# EAGLE design wavplayer-v1 (EAGLE 6.5.0)
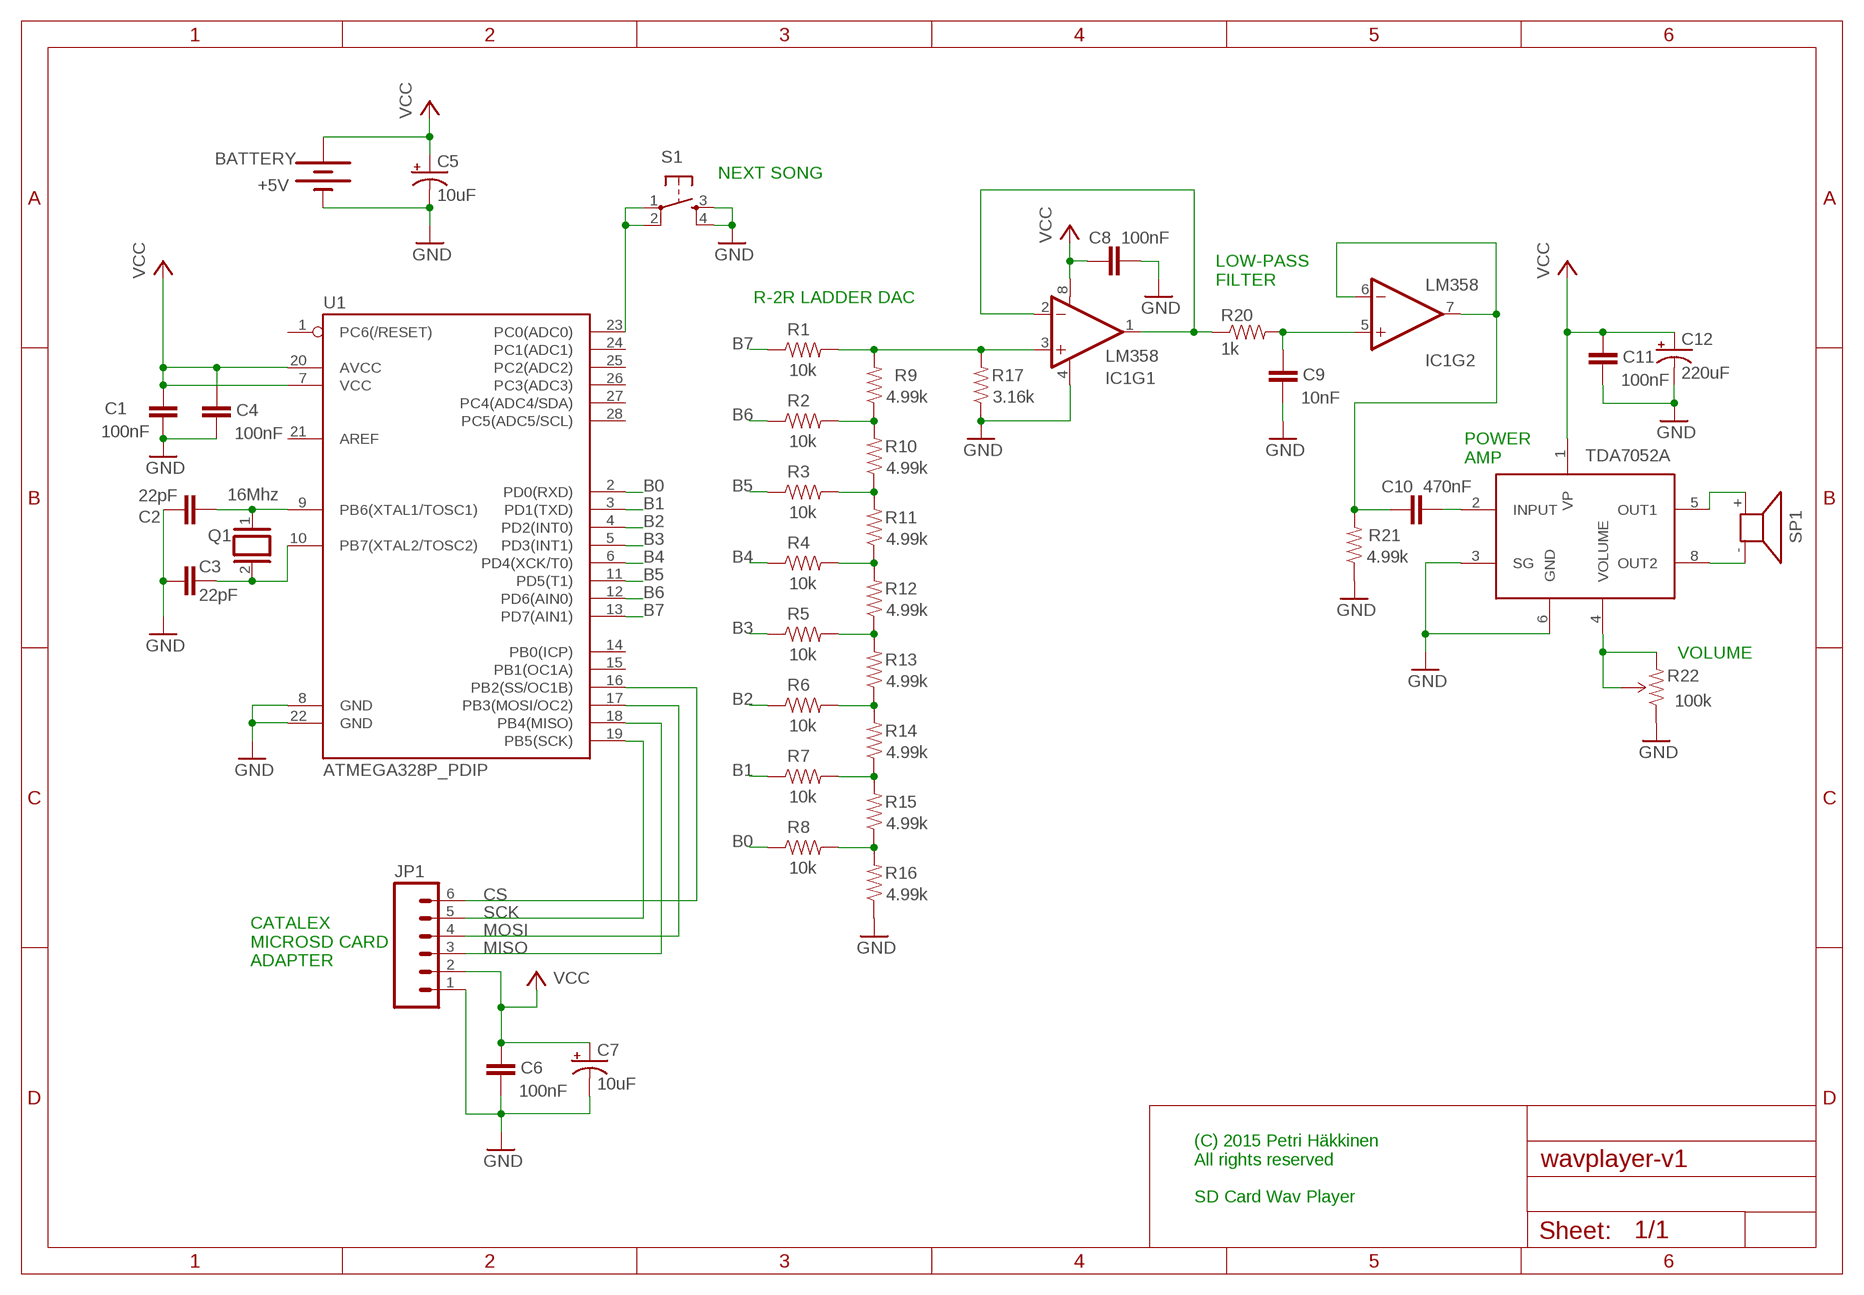
[diagram p0: schematic, sheet 1]

## Parts
BATTERY  +5V  BATTERYAA  [BATTERY-AA]
C1  100nF  CAPPTH  [CAP-PTH-SMALL]
C2  22pF  CAPPTH  [CAP-PTH-SMALL]
C3  22pF  CAPPTH  [CAP-PTH-SMALL]
C4  100nF  CAPPTH  [CAP-PTH-SMALL]
C5  10uF  CAP_POLPTH1  [CPOL-RADIAL-100UF-25V]
C6  100nF  CAPPTH  [CAP-PTH-SMALL]
C7  10uF  CAP_POLPTH1  [CPOL-RADIAL-100UF-25V]
C8  100nF  CAPPTH  [CAP-PTH-SMALL]
C9  10nF  CAPPTH  [CAP-PTH-SMALL]
C10  470nF  CAPPTH  [CAP-PTH-SMALL]
C11  100nF  CAPPTH  [CAP-PTH-SMALL]
C12  220uF  CAP_POLPTH1  [CPOL-RADIAL-100UF-25V]
IC1  LM358  [DIP08]
JP1  M06LONGPADS  [1X06_LONGPADS]
Q1  16Mhz  XTAL/S  [QS]
R1  10k  RESISTORPTH-1/4W  [AXIAL-0.4]
R2  10k  RESISTORPTH-1/4W  [AXIAL-0.4]
R3  10k  RESISTORPTH-1/4W  [AXIAL-0.4]
R4  10k  RESISTORPTH-1/4W  [AXIAL-0.4]
R5  10k  RESISTORPTH-1/4W  [AXIAL-0.4]
R6  10k  RESISTORPTH-1/4W  [AXIAL-0.4]
R7  10k  RESISTORPTH-1/4W  [AXIAL-0.4]
R8  10k  RESISTORPTH-1/4W  [AXIAL-0.4]
R9  4.99k  RESISTORPTH-1/4W  [AXIAL-0.4]
R10  4.99k  RESISTORPTH-1/4W  [AXIAL-0.4]
R11  4.99k  RESISTORPTH-1/4W  [AXIAL-0.4]
R12  4.99k  RESISTORPTH-1/4W  [AXIAL-0.4]
R13  4.99k  RESISTORPTH-1/4W  [AXIAL-0.4]
R14  4.99k  RESISTORPTH-1/4W  [AXIAL-0.4]
R15  4.99k  RESISTORPTH-1/4W  [AXIAL-0.4]
R16  4.99k  RESISTORPTH-1/4W  [AXIAL-0.4]
R17  3.16k  RESISTORPTH-1/4W  [AXIAL-0.4]
R20  1k  RESISTORPTH-1/4W  [AXIAL-0.4]
R21  4.99k  RESISTORPTH-1/4W  [AXIAL-0.4]
R22  100k  TRIMPOTPTH  [TRIM_POT_PTH]
S1  TAC_SWITCHPTH  [TACTILE-PTH]
SP1  AL11P  [AL11P]
U1  ATMEGA328P_PDIP  [DIL28-3]
U$1  TDA7052B  [DIL08]

## Nets
B0: R8.P$1 U1.2(PD0(RXD))
B1: R7.P$1 U1.3(PD1(TXD))
B2: R6.P$1 U1.4(PD2(INT0))
B3: R5.P$1 U1.5(PD3(INT1))
B4: R4.P$1 U1.6(PD4(XCK/T0))
B5: R3.P$1 U1.11(PD5(T1))
B6: R2.P$1 U1.12(PD6(AIN0))
B7: R1.P$1 U1.13(PD7(AIN1))
CS: JP1.6 U1.16(PB2(SS/OC1B))
GND: BATTERY.GND@1(-) C1.2 C2.2 C3.2 C4.2 C5.2(-) C6.2 C7.2(-) C8.2 C9.2 C11.2 C12.2(-) IC1.4(V-) JP1.1 R16.P$1 R17.P$1 R21.P$1 R22.1(CCW) S1.3 S1.4 U1.8(GND) U1.22(GND) U$1.3(SG) U$1.6(GND)
MISO: JP1.3 U1.18(PB4(MISO))
MOSI: JP1.4 U1.17(PB3(MOSI/OC2))
N$1: C2.1 Q1.1 U1.9(PB6(XTAL1/TOSC1))
N$2: C3.1 Q1.2 U1.10(PB7(XTAL2/TOSC2))
N$3: R4.P$2 R11.P$1 R12.P$2
N$4: R5.P$2 R12.P$1 R13.P$2
N$5: R6.P$2 R13.P$1 R14.P$2
N$6: R3.P$2 R10.P$1 R11.P$2
N$7: R7.P$2 R14.P$1 R15.P$2
N$8: R2.P$2 R9.P$1 R10.P$2
N$9: R8.P$2 R15.P$1 R16.P$2
N$10: IC1.3(+IN) R1.P$2 R9.P$2 R17.P$2
N$11: C9.1 IC1.5(+IN) R20.P$2
N$12: C10.1 IC1.6(-IN) IC1.7(OUT) R21.P$2
N$13: IC1.1(OUT) IC1.2(-IN) R20.P$1
N$14: SP1.- U$1.8(OUT2)
N$15: C8.1 IC1.8(V+) ; supply symbol labelled VCC
N$16: SP1.+ U$1.5(OUT1)
N$18: C10.2 U$1.2(INPUT)
N$19: R22.2(WIPER) R22.3(CW) U$1.4(VOLUME)
N$25: S1.1 S1.2 U1.23(PC0(ADC0))
SCK: JP1.5 U1.19(PB5(SCK))
VCC: BATTERY.PWR@1(+) C1.1 C4.1 C5.1(+) C6.1 C7.1(+) C11.1 C12.1(+) JP1.2 U1.7(VCC) U1.20(AVCC) U$1.1(VP)
Unconnected: U1.1(PC6(/RESET)) U1.14(PB0(ICP)) U1.15(PB1(OC1A)) U1.21(AREF) U1.24(PC1(ADC1)) U1.25(PC2(ADC2)) U1.26(PC3(ADC3)) U1.27(PC4(ADC4/SDA)) U1.28(PC5(ADC5/SCL))

## Notes on the sheet
- NEXT SONG
- LOW-PASS
  FILTER
- R-2R LADDER DAC
- TDA7052A
- POWER
  AMP
- VOLUME
- CATALEX
  MICROSD CARD
  ADAPTER
- (C) 2015 Petri Häkkinen
  All rights reserved
  
  SD Card Wav Player

## Library data of the parts
BATTERY = SparkFun-Electromechanical:BATTERY: Battery Holders Various common sizes : AA, AAA, 20mm coin cell and 12mm coin cell. 20MM_4LEGS, BATT-10373
C1-C4 C6 C8-C11 = SparkFun-Capacitors:CAP: Capacitor Standard 0603 ceramic capacitor, and 0.1" leaded capacitor.
C5 C7 C12 = SparkFun-Capacitors:CAP_POL: Capacitor Polarized These are standard SMD and PTH capacitors. Normally 10uF, 47uF, and 100uF in electrolytic and tantalum varieties. Always verify the external diameter of the through hole cap, it varies with capacity, voltage, and manufacturer. The EIA devices should be standard.
IC1 = SparkFun-AnalogIC:LM358: Jellybean op-amp; PROD_ID: IC-09172
JP1 = SparkFun-Connectors:M06: Header 6 Standard 6-pin 0.1" header. Use with straight break away headers (SKU : PRT-00116), right angle break away headers (PRT-00553), swiss pins (PRT-00743), machine pins (PRT-00117), and female headers (PRT-00115). Molex polarized connector foot print use with SKU : PRT-08094 with associated crimp pins and housings. NOTES ON THE VARIANTS LOCK and LOCK_LONGPADS... This footprint was designed to help hold the alignment of a through-hole component (i.e. 6-pin header) while soldering it into place. You may notice that each hole has been shifted either up or down by 0.005 of an inch from it's more standard position (which is a perfectly straight line). This slight alteration caused the pins (the squares in the middle) to touch the edges of the holes. Because they are alternating, it causes a "brace" to hold the component in place. 0.005 has proven to be the perfect amount of "off-center" position when using our standard breakaway headers. Although looks a little odd when you look at the bare footprint, once you have a header in there, the alteration is very hard to notice. Also,if you push a header all the way into place, it is covered up entirely on the bottom side. This idea of altering the position of holes to aid alignment will be further integrated into the Sparkfun Library for other footprints. It can help hold any component with 3 or more connection pins.
Q1 = special:XTAL/S: CRYSTAL
R1-R17 R20 R21 = SparkFun-Passives:RESISTOR: Resistor Basic schematic elements and footprints for 0603, 1206, and PTH resistors.
R22 = SparkFun-Electromechanical:TRIMPOT: Various small potentiometers for "set-and-forget" applications
S1 = SparkFun-Electromechanical:TAC_SWITCH: Momentary Switch Button commonly used for reset or general input. Spark Fun Electronics SKU : COM-00097 SMT- SWCH-08247
SP1 = buzzer:AL11P: SPEAKER Source: Buerklin; OC_FARNELL: unknown; OC_NEWARK: unknown
U1 = SparkFun-DigitalIC:ATMEGA328P_PDIP: uC used in the Arduino 32kb flash, 1k EEPROM, 2k SRAM This is the through-hole version of this chip.
U$1 = tda7052b:TDA7052B: 1W Mono audio amplifier

## Board
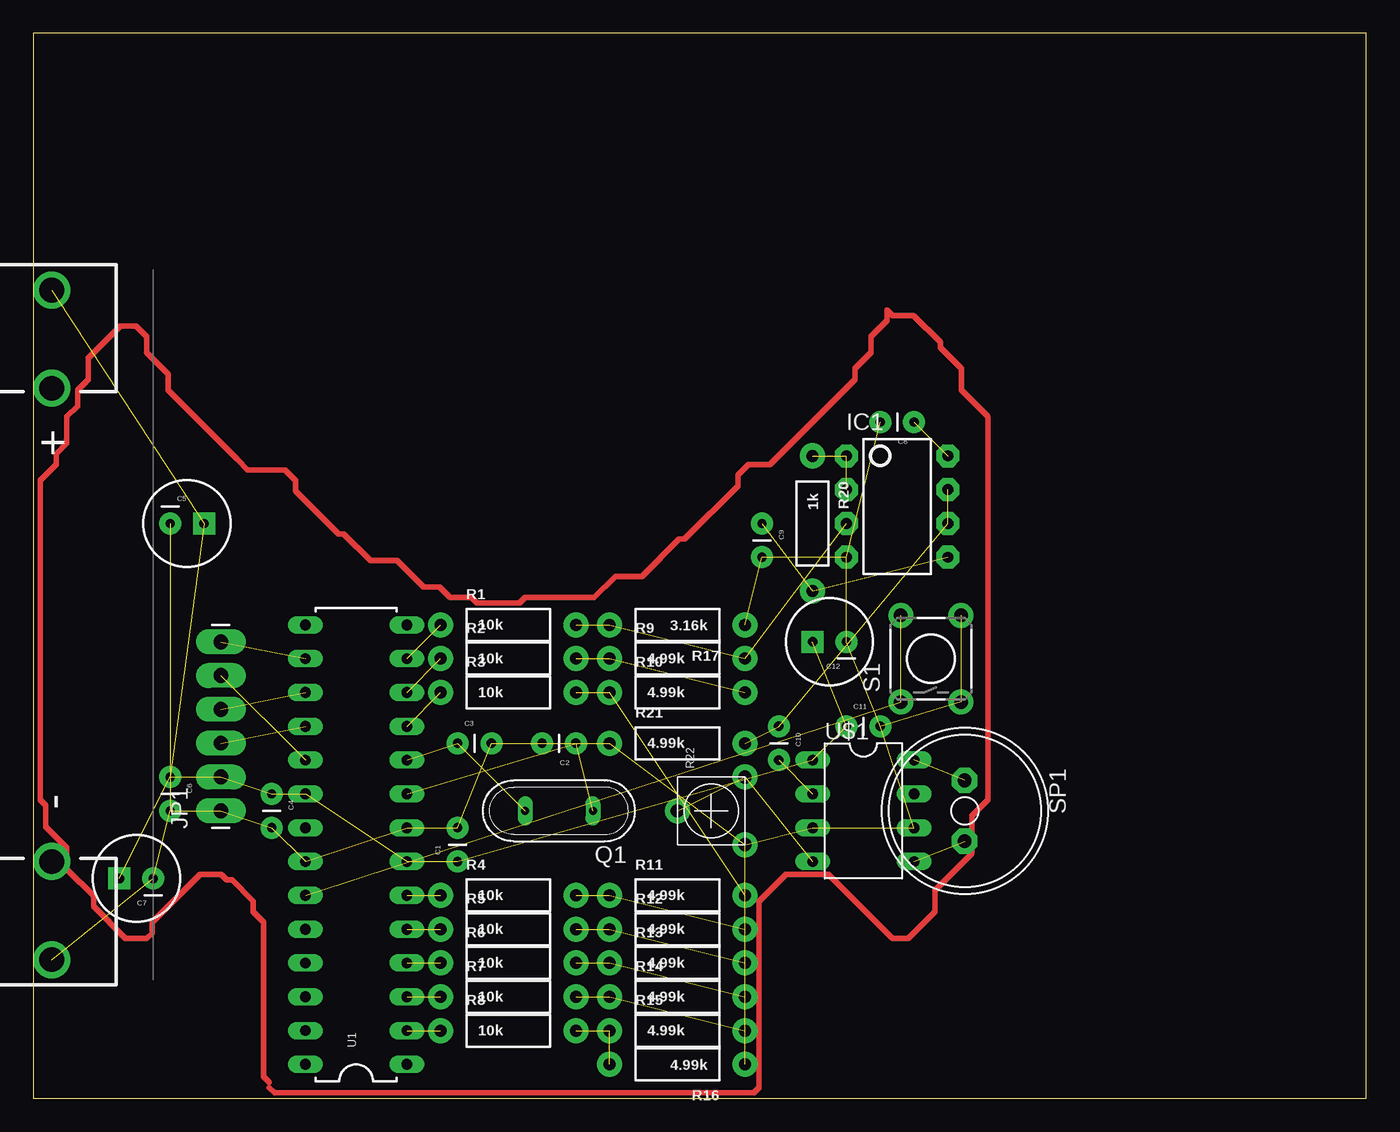
[diagram p1: board, top side]

Size 100.12 x 80 mm. Coordinates in mm from the lower left corner, seen from the top.
Outline: 0,0 100.12,0 100.12,80 0,80 0,0
Copper layers (1*16): Top 0.035mm / dielectric 1.5mm / Bottom 0.035mm
Design rules "default": minimum track width 10mil, minimum drill 24mil, track to track 8mil, track to pad 8mil, pad to pad 8mil, via to via 8mil, smd to smd 8mil, copper to edge 40mil, drill to drill 8mil, minimum pad ring 10mil, minimum via ring 8mil, stop-mask expansion 4mil, vias tented up to drill 0mil, thermal gap 10mil

### Footprints (pad centres in the part's own frame; a part is rotated, then mirrored left to right if it is on the bottom)
BATTERY-AA = drill 1.854: GND@1 25.146,0; GND@2 17.78,0; PWR@1 -25.146,0; PWR@2 -17.78,0
CAP-PTH-SMALL = drill 0.7 pad 1.651: 1 0,0; 2 2.54,0
CPOL-RADIAL-100UF-25V = drill 0.7 pad 1.651 square: 1 1.27,0 | drill 0.7 pad 1.651: 2 -1.27,0
DIP08 = drill 0.813 pad 1.727 octagon: 1 -3.81,-3.81; 2 -1.27,-3.81; 3 1.27,-3.81; 4 3.81,-3.81; 5 3.81,3.81; 6 1.27,3.81; 7 -1.27,3.81; 8 -3.81,3.81
1X06_LONGPADS = drill 1.118 pad 1.88 long: 1 0,0; 2 2.54,0; 3 5.08,0; 4 7.62,0; 5 10.16,0; 6 12.7,0
QS = drill 0.61 long: 1 -2.54,0; 2 2.54,0
AXIAL-0.4 = drill 0.9 pad 1.88: P$1 -5.08,0; P$2 5.08,0
TRIM_POT_PTH = drill 1 pad 1.88: 1 -2.54,-2.54; 2 0,2.54; 3 2.54,-2.54
TACTILE-PTH = drill 1.016 pad 1.88: 1 -3.251,2.261; 2 3.251,2.261; 3 -3.251,-2.261; 4 3.251,-2.261
AL11P = drill 1.016 pad 1.905 octagon: + 2.286,0; - -2.286,0
DIL28-3 = drill 0.813 long: 1 -16.51,-3.81; 2 -13.97,-3.81; 3 -11.43,-3.81; 4 -8.89,-3.81; 5 -6.35,-3.81; 6 -3.81,-3.81; 7 -1.27,-3.81; 8 1.27,-3.81; 9 3.81,-3.81; 10 6.35,-3.81; 11 8.89,-3.81; 12 11.43,-3.81; 13 13.97,-3.81; 14 16.51,-3.81; 15 16.51,3.81; 16 13.97,3.81; 17 11.43,3.81; 18 8.89,3.81; 19 6.35,3.81; 20 3.81,3.81; 21 1.27,3.81; 22 -1.27,3.81; 23 -3.81,3.81; 24 -6.35,3.81; 25 -8.89,3.81; 26 -11.43,3.81; 27 -13.97,3.81; 28 -16.51,3.81
DIL08 = drill 0.813 long: 1 -3.81,-3.81; 2 -1.27,-3.81; 3 1.27,-3.81; 4 3.81,-3.81; 5 3.81,3.81; 6 1.27,3.81; 7 -1.27,3.81; 8 -3.81,3.81

### Placement (x,y rotation side)
BATTERY  1.39,35.56 270 top
C1  31.87,17.78 90 top
C2  40.76,26.67 180 top
C3  31.87,26.67 0 top
C4  17.9,22.86 270 top
C5  11.55,43.18 0 top
C6  10.28,24.13 270 top
C7  7.74,16.51 180 top
C8  66.16,50.8 180 top
C9  54.73,43.18 270 top
C10  56,27.94 270 top
C11  61.08,27.94 0 top
C12  59.81,34.29 180 top
IC1  64.89,44.45 270 top
JP1  14.09,21.59 90 top
Q1  39.49,21.59 180 top
R1  35.68,35.56 0 top
R2  35.68,33.02 0 top
R3  35.68,30.48 0 top
R4  35.68,15.24 0 top
R5  35.68,12.7 0 top
R6  35.68,10.16 0 top
R7  35.68,7.62 0 top
R8  35.68,5.08 0 top
R9  48.38,33.02 0 top
R10  48.38,30.48 0 top
R11  48.38,15.24 0 top
R12  48.38,12.7 0 top
R13  48.38,10.16 0 top
R14  48.38,7.62 0 top
R15  48.38,5.08 0 top
R16  48.38,2.54 180 top
R17  48.38,35.56 180 top
R20  58.54,43.18 270 top
R21  48.38,26.67 0 top
R22  50.92,21.59 90 top
S1  67.43,33.02 90 top
SP1  69.97,21.59 270 top
U1  24.25,19.05 90 top
U$1  62.35,21.59 270 top

### Tracks (layer width: path | path; a pad name or v marks a point on that pad's centre or on a via)
B0  (1 unrouted)
B1  (1 unrouted)
B2  (1 unrouted)
B3  (1 unrouted)
B4  (1 unrouted)
B5  (1 unrouted)
B6  (1 unrouted)
B7  (1 unrouted)
CS  (1 unrouted)
GND  (23 unrouted)
MISO  (1 unrouted)
MOSI  (1 unrouted)
N$1  (2 unrouted)
N$2  (2 unrouted)
N$3  (2 unrouted)
N$4  (2 unrouted)
N$5  (2 unrouted)
N$6  (2 unrouted)
N$7  (2 unrouted)
N$8  (2 unrouted)
N$9  (2 unrouted)
N$10  (3 unrouted)
N$11  (2 unrouted)
N$12  (3 unrouted)
N$13  (2 unrouted)
N$14  (1 unrouted)
N$15  (1 unrouted)
N$16  (1 unrouted)
N$18  (1 unrouted)
N$19  (2 unrouted)
N$21
  Top 0.406: 17.72,0.8 18.12,0.4 54.12,0.4 54.52,0.8 54.52,14.8 56.52,16.8 59.72,16.8 64.52,12 65.72,12 67.72,14 67.72,15.6 70.52,18.4 70.52,21.2 71.72,22.4 71.72,51.2 69.72,53.2 69.72,54.8 68.12,56.4 68.12,56.8 66.12,58.8 64.52,58.8 64.12,59.2 64.12,58.4 62.92,57.2 62.92,56 61.72,54.8 61.72,54 55.32,47.6 53.72,47.6 52.92,46.8 52.92,46 48.92,42 48.52,42 45.72,39.2 43.72,39.2 42.12,37.6 36.92,37.6 36.52,37.2 33.32,37.2 32.92,37.6 31.32,37.6 30.52,38.4 29.32,38.4 27.32,40.4 25.32,40.4 23.32,42.4 22.92,42.4 19.72,45.6 19.72,46.4 18.92,47.2 16.12,47.2 15.32,48 | 15.32,48 | 15.32,48 10.12,53.2 10.12,54.4 8.52,56 8.52,57.2 7.72,58 6.52,58 4.12,55.6 4.12,54 3.32,53.2 3.32,52 2.52,51.2 2.52,49.2 1.72,48.4 1.72,47.6 0.52,46.4 0.52,22.4 0.92,22 0.92,20.4 2.52,18.8 2.52,17.2 4.52,15.2 4.52,14.4 6.92,12 8.52,12 8.92,12.4 8.92,13.2 12.52,16.8 14.12,16.8 14.52,16.4 14.92,16.4 16.52,14.8 16.52,14 17.32,13.2 17.32,1.6 17.72,1.2
N$25  (2 unrouted)
SCK  (1 unrouted)
VCC  (11 unrouted)

### Text on the board
201bmp: /Users/petri/Documents/eagle/wavplayer/pcb_mask_small.bmp